# Altium schematic sheet Buttons.SchDoc
size Letter
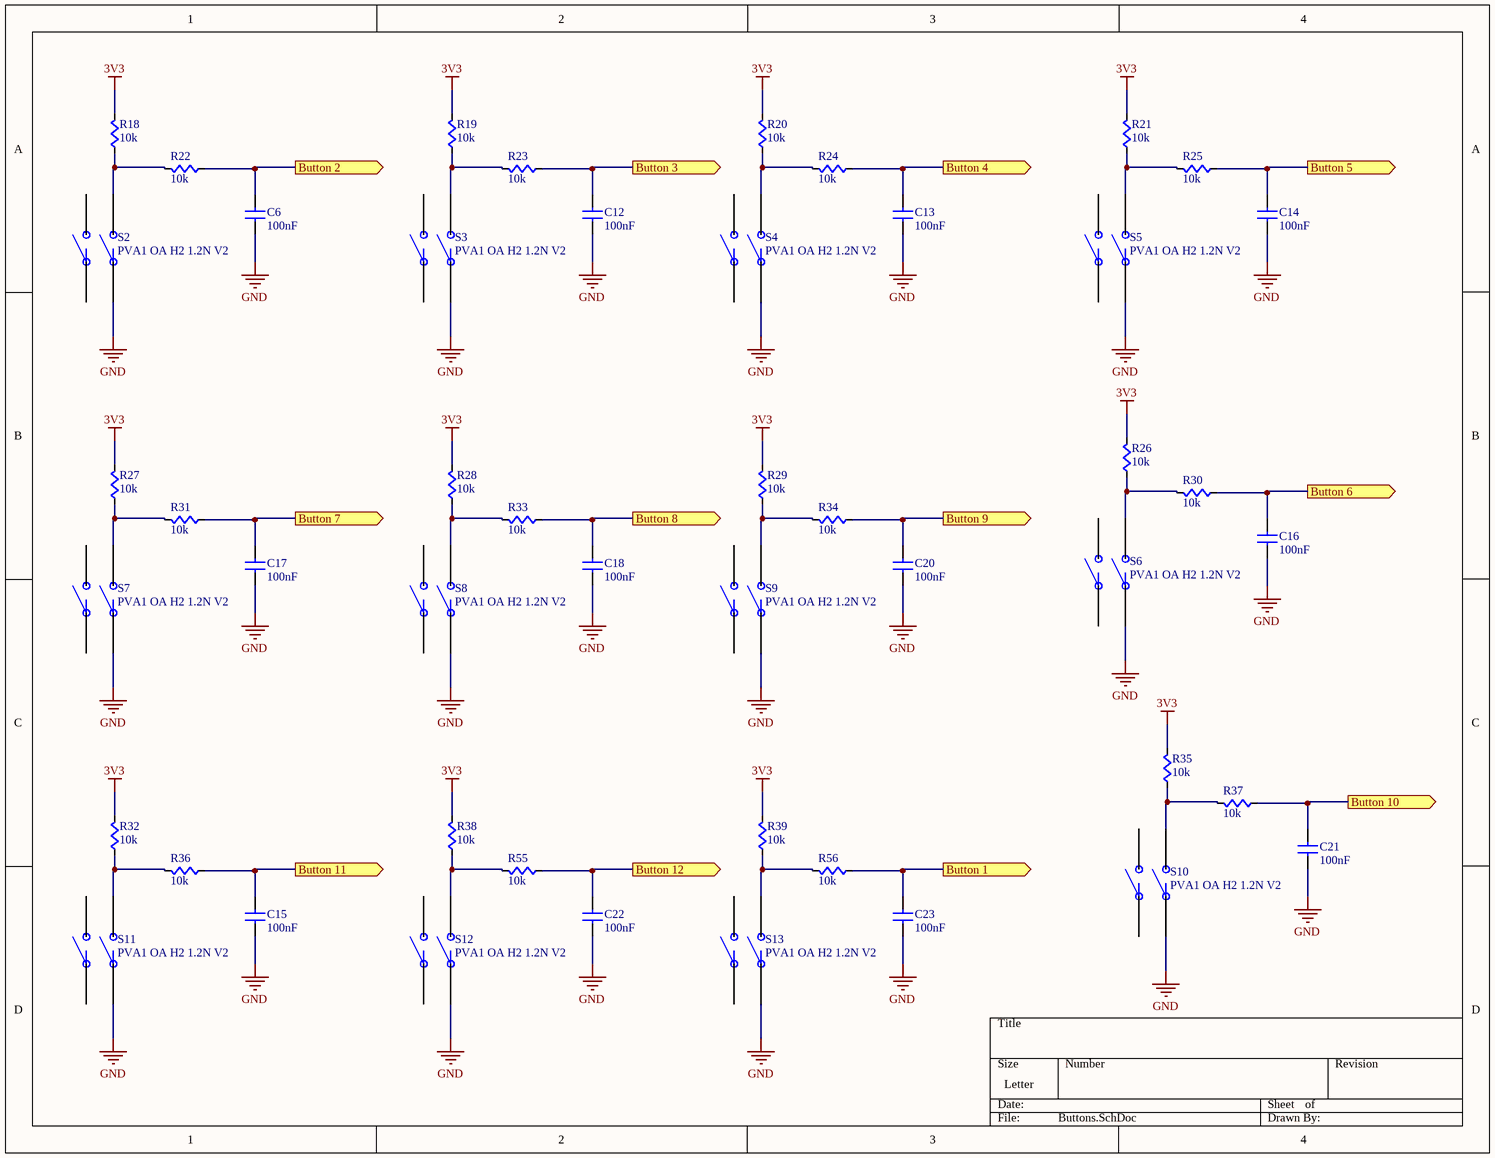
[diagram p0: Buttons.SchDoc]

## Parts
C6  value 100nF  [CAPC0603]  (hidden comment: Cap)
C12  value 100nF  [CAPC0603]  (hidden comment: Cap)
C13  value 100nF  [CAPC0603]  (hidden comment: Cap)
C14  value 100nF  [CAPC0603]  (hidden comment: Cap)
C15  value 100nF  [CAPC0603]  (hidden comment: Cap)
C16  value 100nF  [CAPC0603]  (hidden comment: Cap)
C17  value 100nF  [CAPC0603]  (hidden comment: Cap)
C18  value 100nF  [CAPC0603]  (hidden comment: Cap)
C20  value 100nF  [CAPC0603]  (hidden comment: Cap)
C21  value 100nF  [CAPC0603]  (hidden comment: Cap)
C22  value 100nF  [CAPC0603]  (hidden comment: Cap)
C23  value 100nF  [CAPC0603]  (hidden comment: Cap)
R18  value 10k  [RES0603]  (hidden comment: Res)
R19  value 10k  [RES0603]  (hidden comment: Res)
R20  value 10k  [RES0603]  (hidden comment: Res)
R21  value 10k  [RES0603]  (hidden comment: Res)
R22  value 10k  [RES0603]  (hidden comment: Res)
R23  value 10k  [RES0603]  (hidden comment: Res)
R24  value 10k  [RES0603]  (hidden comment: Res)
R25  value 10k  [RES0603]  (hidden comment: Res)
R26  value 10k  [RES0603]  (hidden comment: Res)
R27  value 10k  [RES0603]  (hidden comment: Res)
R28  value 10k  [RES0603]  (hidden comment: Res)
R29  value 10k  [RES0603]  (hidden comment: Res)
R30  value 10k  [RES0603]  (hidden comment: Res)
R31  value 10k  [RES0603]  (hidden comment: Res)
R32  value 10k  [RES0603]  (hidden comment: Res)
R33  value 10k  [RES0603]  (hidden comment: Res)
R34  value 10k  [RES0603]  (hidden comment: Res)
R35  value 10k  [RES0603]  (hidden comment: Res)
R36  value 10k  [RES0603]  (hidden comment: Res)
R37  value 10k  [RES0603]  (hidden comment: Res)
R38  value 10k  [RES0603]  (hidden comment: Res)
R39  value 10k  [RES0603]  (hidden comment: Res)
R55  value 10k  [RES0603]  (hidden comment: Res)
R56  value 10k  [RES0603]  (hidden comment: Res)
S2  PVA1 OA H2 1.2N V2  [PVA1 OA H2 1.2N V2]
S3  PVA1 OA H2 1.2N V2  [PVA1 OA H2 1.2N V2]
S4  PVA1 OA H2 1.2N V2  [PVA1 OA H2 1.2N V2]
S5  PVA1 OA H2 1.2N V2  [PVA1 OA H2 1.2N V2]
S6  PVA1 OA H2 1.2N V2  [PVA1 OA H2 1.2N V2]
S7  PVA1 OA H2 1.2N V2  [PVA1 OA H2 1.2N V2]
S8  PVA1 OA H2 1.2N V2  [PVA1 OA H2 1.2N V2]
S9  PVA1 OA H2 1.2N V2  [PVA1 OA H2 1.2N V2]
S10  PVA1 OA H2 1.2N V2  [PVA1 OA H2 1.2N V2]
S11  PVA1 OA H2 1.2N V2  [PVA1 OA H2 1.2N V2]
S12  PVA1 OA H2 1.2N V2  [PVA1 OA H2 1.2N V2]
S13  PVA1 OA H2 1.2N V2  [PVA1 OA H2 1.2N V2]

## Ports
Button 1 (out), Button 2 (out), Button 3 (out), Button 4 (out), Button 5 (out), Button 6 (out), Button 7 (out), Button 8 (out), Button 9 (out), Button 10 (out), Button 11 (out), Button 12 (out)

## Nets
3V3: R18.1(A) R19.1(A) R20.1(A) R21.1(A) R26.1(A) R27.1(A) R28.1(A) R29.1(A) R32.1(A) R35.1(A) R38.1(A) R39.1(A)
GND: C6.2(B) C12.2(B) C13.2(B) C14.2(B) C15.2(B) C16.2(B) C17.2(B) C18.2(B) C20.2(B) C21.2(B) C22.2(B) C23.2(B) S2.3 S3.3 S4.3 S5.3 S6.3 S7.3 S8.3 S9.3 S10.3 S11.3 S12.3 S13.3
Button 1: C23.1(A) R56.2(B) ; port Button 1
Button 2: C6.1(A) R22.2(B) ; port Button 2
Button 3: C12.1(A) R23.2(B) ; port Button 3
Button 4: C13.1(A) R24.2(B) ; port Button 4
Button 5: C14.1(A) R25.2(B) ; port Button 5
Button 6: C16.1(A) R30.2(B) ; port Button 6
Button 7: C17.1(A) R31.2(B) ; port Button 7
Button 8: C18.1(A) R33.2(B) ; port Button 8
Button 9: C20.1(A) R34.2(B) ; port Button 9
Button 10: C21.1(A) R37.2(B) ; port Button 10
Button 11: C15.1(A) R36.2(B) ; port Button 11
Button 12: C22.1(A) R55.2(B) ; port Button 12
NetR18_2: R18.2(B) R22.1(A) S2.4
NetR19_2: R19.2(B) R23.1(A) S3.4
NetR20_2: R20.2(B) R24.1(A) S4.4
NetR21_2: R21.2(B) R25.1(A) S5.4
NetR26_2: R26.2(B) R30.1(A) S6.4
NetR27_2: R27.2(B) R31.1(A) S7.4
NetR28_2: R28.2(B) R33.1(A) S8.4
NetR29_2: R29.2(B) R34.1(A) S9.4
NetR32_2: R32.2(B) R36.1(A) S11.4
NetR35_2: R35.2(B) R37.1(A) S10.4
NetR38_2: R38.2(B) R55.1(A) S12.4
NetR39_2: R39.2(B) R56.1(A) S13.4

Not connected (* = marked no-connect by the designer): S2 1 2; S3 1 2; S4 1 2; S5 1 2; S6 1 2; S7 1 2; S8 1 2; S9 1 2; S10 1 2; S11 1 2; S12 1 2; S13 1 2

## Library data of the parts
S2-S13 = PVA1 OA H2 1.2N V2: Pushbutton Switch DPST-NO Keyswitch Through Hole; Manufacturer: C&K; Supplier 1: Digi-Key; Supplier Part Number 1: 401-1135-ND; Manufacturer Part Number: PVA1 OA H2 1.2N V2; ComponentLink1URL: https://www.ckswitches.com/media/1343/pva.pdf; ComponentLink1Description: Datasheet; ComponentLink2URL: *
C6 C12-C18 C20-C23 = Cap: Supplier 1: Digi-Key; Supplier Part Number 1: 1276-1000-1-ND
R18-R39 R55 R56 = Res: Supplier 1: Digi-Key; Supplier Part Number 1: RMCF0603FT10K0CT-ND